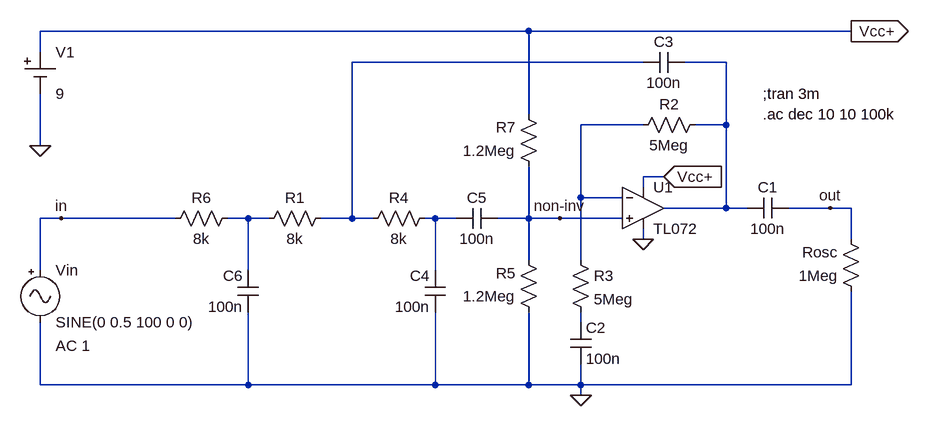
[diagram p0: schematic sallen-key-low-pass.asc]
sallen-key-low-pass.asc, the LTspice schematic file:
Version 4
SHEET 1 1284 680
WIRE -32 -128 -784 -128
WIRE 464 -128 -32 -128
WIRE -784 -96 -784 -128
WIRE 144 -80 -304 -80
WIRE 272 -80 208 -80
WIRE -32 0 -32 -128
WIRE 144 16 48 16
WIRE 272 16 272 -80
WIRE 272 16 224 16
WIRE -784 48 -784 -32
WIRE 176 96 144 96
WIRE 144 112 144 96
WIRE 48 128 48 16
WIRE 112 128 48 128
WIRE 272 144 272 16
WIRE 272 144 176 144
WIRE 304 144 272 144
WIRE 432 144 368 144
WIRE 464 144 432 144
WIRE -752 160 -784 160
WIRE -576 160 -752 160
WIRE -464 160 -496 160
WIRE -432 160 -464 160
WIRE -304 160 -304 -80
WIRE -304 160 -352 160
WIRE -272 160 -304 160
WIRE -176 160 -192 160
WIRE -144 160 -176 160
WIRE -32 160 -32 80
WIRE -32 160 -80 160
WIRE 16 160 -32 160
WIRE 112 160 16 160
WIRE 144 192 144 176
WIRE 464 192 464 144
WIRE -32 224 -32 160
WIRE 48 224 48 128
WIRE -784 240 -784 160
WIRE -464 240 -464 160
WIRE -176 240 -176 160
WIRE 48 320 48 304
WIRE -784 416 -784 320
WIRE -464 416 -464 304
WIRE -464 416 -784 416
WIRE -176 416 -176 304
WIRE -176 416 -464 416
WIRE -32 416 -32 304
WIRE -32 416 -176 416
WIRE 48 416 48 384
WIRE 48 416 -32 416
WIRE 464 416 464 272
WIRE 464 416 48 416
WIRE 48 432 48 416
FLAG -784 48 0
FLAG 464 -128 Vcc+
IOPIN 464 -128 Out
FLAG -752 160 in
FLAG 144 192 0
FLAG 48 432 0
FLAG 176 96 Vcc+
IOPIN 176 96 In
FLAG 432 144 out
FLAG 16 160 non-inv
SYMBOL TL072 144 80 R0
SYMATTR InstName U1
SYMBOL res 240 0 R90
WINDOW 0 0 56 VBottom 2
WINDOW 3 32 56 VTop 2
SYMATTR InstName R2
SYMATTR Value 5Meg
SYMBOL signal -784 224 R0
WINDOW 123 24 132 Left 2
WINDOW 39 24 160 Left 2
SYMATTR Value2 AC 1
SYMATTR InstName Vin
SYMATTR Value SINE(0 0.5 100 0 0)
SYMBOL cell -784 -96 R0
WINDOW 123 0 0 Left 2
WINDOW 39 0 0 Left 2
SYMATTR InstName V1
SYMATTR Value 9
SYMBOL cap 368 128 R90
WINDOW 0 0 32 VBottom 2
WINDOW 3 32 32 VTop 2
SYMATTR InstName C1
SYMATTR Value 100n
SYMBOL res 32 208 R0
SYMATTR InstName R3
SYMATTR Value 5Meg
SYMBOL cap 32 384 M180
WINDOW 0 24 56 Left 2
WINDOW 3 24 8 Left 2
SYMATTR InstName C2
SYMATTR Value 100n
SYMBOL cap -144 176 R270
WINDOW 0 32 32 VTop 2
WINDOW 3 0 32 VBottom 2
SYMATTR InstName C5
SYMATTR Value 100n
SYMBOL res -16 320 R180
WINDOW 0 36 76 Left 2
WINDOW 3 36 40 Left 2
SYMATTR InstName R5
SYMATTR Value 1.2Meg
SYMBOL res 480 288 R180
WINDOW 0 36 76 Left 2
WINDOW 3 36 40 Left 2
SYMATTR InstName Rosc
SYMATTR Value 1Meg
SYMBOL res -448 176 R270
WINDOW 0 32 56 VTop 2
WINDOW 3 0 56 VBottom 2
SYMATTR InstName R1
SYMATTR Value 8k
SYMBOL res -288 176 R270
WINDOW 0 32 56 VTop 2
WINDOW 3 0 56 VBottom 2
SYMATTR InstName R4
SYMATTR Value 8k
SYMBOL cap -160 240 M0
SYMATTR InstName C4
SYMATTR Value 100n
SYMBOL res -16 96 R180
WINDOW 0 36 76 Left 2
WINDOW 3 36 40 Left 2
SYMATTR InstName R7
SYMATTR Value 1.2Meg
SYMBOL cap 208 -96 R90
WINDOW 0 0 32 VBottom 2
WINDOW 3 32 32 VTop 2
SYMATTR InstName C3
SYMATTR Value 100n
SYMBOL res -592 176 R270
WINDOW 0 32 56 VTop 2
WINDOW 3 0 56 VBottom 2
SYMATTR InstName R6
SYMATTR Value 8k
SYMBOL cap -448 240 M0
SYMATTR InstName C6
SYMATTR Value 100n
TEXT 328 -32 Left 2 !;tran 3m
TEXT 328 0 Left 2 !.ac dec 10 10 100k

The netlist it stands for:
* sallen-key-low-pass.asc
* U1: TL072 (symbol TL072 not available, pins judged from their places): In+=non-inv In-=N003 V+=Vcc+ V-=0 OUT=N002
R2 N002 N003 5Meg
Vin in 0 SINE(0 0.5 100 0 0) AC 1
V1 Vcc+ 0 9
C1 out N002 100n
R3 N003 N006 5Meg
C2 0 N006 100n
C5 N005 non-inv 100n
R5 0 non-inv 1.2Meg
Rosc 0 out 1Meg
R1 N004 N001 8k
R4 N001 N005 8k
C4 N005 0 100n
R7 non-inv Vcc+ 1.2Meg
C3 N002 N001 100n
R6 in N004 8k
C6 N004 0 100n
;tran 3m
.ac dec 10 10 100k
.backanno
.end